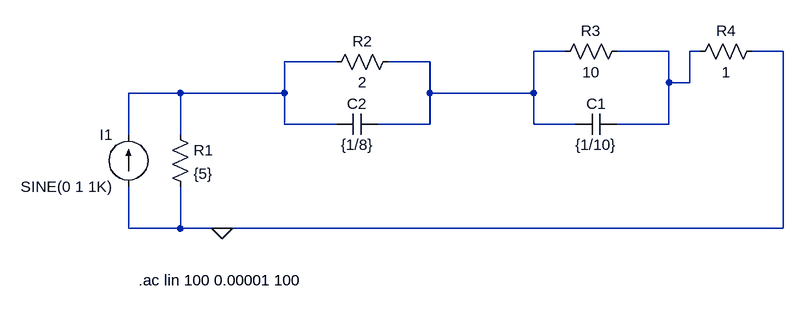
[diagram p0: schematic Ej.asc]
Ej.asc, the LTspice schematic file:
Version 4
SHEET 1 1092 680
WIRE 752 192 704 192
WIRE 912 192 832 192
WIRE 960 192 944 192
WIRE 1088 192 1040 192
WIRE 400 208 320 208
WIRE 544 208 480 208
WIRE 912 240 912 192
WIRE 944 240 944 192
WIRE 944 240 912 240
WIRE 160 256 80 256
WIRE 320 256 320 208
WIRE 320 256 160 256
WIRE 544 256 544 208
WIRE 704 256 704 192
WIRE 704 256 544 256
WIRE 320 304 320 256
WIRE 400 304 320 304
WIRE 544 304 544 256
WIRE 544 304 464 304
WIRE 704 304 704 256
WIRE 768 304 704 304
WIRE 912 304 912 240
WIRE 912 304 832 304
WIRE 80 320 80 256
WIRE 160 320 160 256
WIRE 80 464 80 400
WIRE 160 464 160 400
WIRE 160 464 80 464
WIRE 224 464 160 464
WIRE 1088 464 1088 192
WIRE 1088 464 224 464
FLAG 224 464 0
SYMBOL Cap 464 288 R90
WINDOW 0 0 32 VBottom 2
WINDOW 3 32 32 VTop 2
SYMATTR InstName C2
SYMATTR Value {1/8}
SYMBOL current 80 400 R180
WINDOW 0 24 80 Left 2
WINDOW 3 24 0 Left 2
SYMATTR InstName I1
SYMATTR Value SINE(0 1 1K)
SYMATTR Value2 AC 1
SYMBOL res 144 304 R0
SYMATTR InstName R1
SYMATTR Value {5}
SYMBOL Res 496 192 R90
WINDOW 0 0 56 VBottom 2
WINDOW 3 32 56 VTop 2
SYMATTR InstName R2
SYMATTR Value 2
SYMBOL Cap 832 288 R90
WINDOW 0 0 32 VBottom 2
WINDOW 3 32 32 VTop 2
SYMATTR InstName C1
SYMATTR Value {1/10}
SYMBOL Res 848 176 R90
WINDOW 0 0 56 VBottom 2
WINDOW 3 32 56 VTop 2
SYMATTR InstName R3
SYMATTR Value 10
SYMBOL Res 1056 176 R90
WINDOW 0 0 56 VBottom 2
WINDOW 3 32 56 VTop 2
SYMATTR InstName R4
SYMATTR Value 1
TEXT 96 544 Left 2 !.ac lin 100 0.00001 100

The netlist it stands for:
* Ej.asc
C2 N001 N003 {1/8}
I1 0 N003 SINE(0 1 1K) AC 1
R1 N003 0 {5}
R2 N001 N003 2
C1 N002 N001 {1/10}
R3 N002 N001 10
R4 0 N002 1
.ac lin 100 0.00001 100
.backanno
.end